# EAGLE schematic Board (EAGLE 7.1.0)
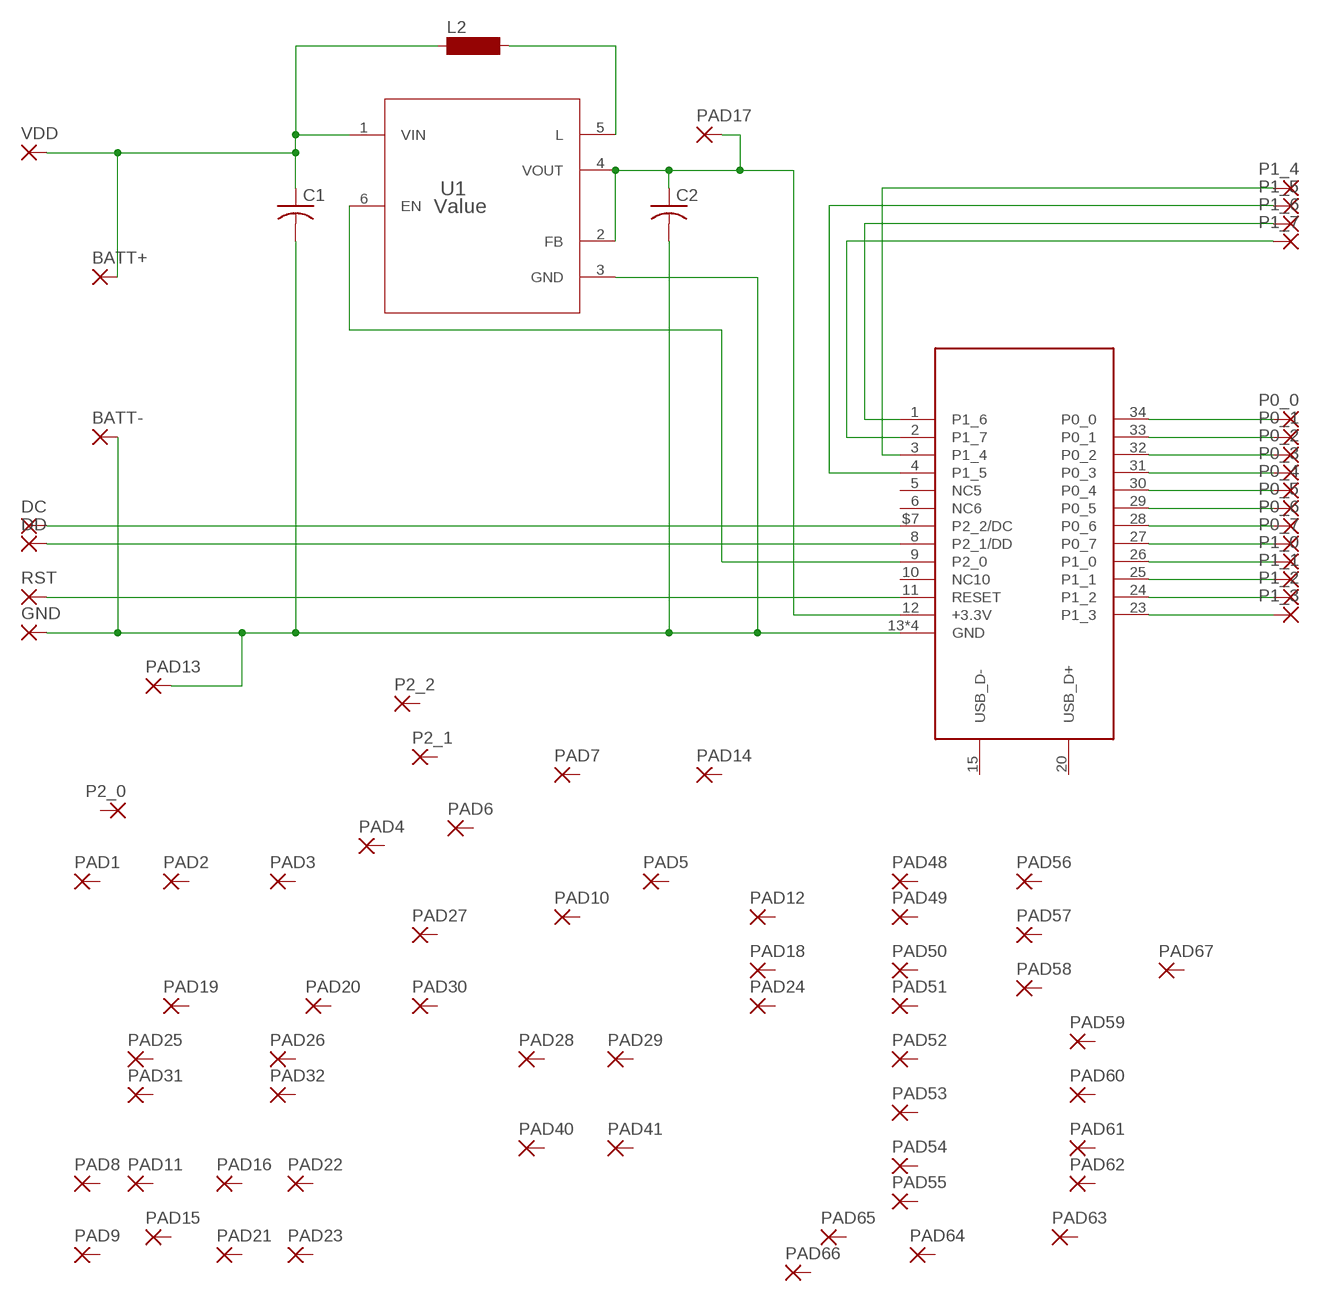
[diagram p0: schematic, sheet 1]

## Parts
BATT+  1,6/0,9  [1,6/0,9]
BATT-  1,6/0,9  [1,6/0,9]
C1  C-USC0402  [C0402]
C2  C-USC0402  [C0402]
DC  SMD2  [SMD1,27-2,54]
DD  SMD2  [SMD1,27-2,54]
E1  HM-10-BOARD  [26.9X13X2.2_BOARD]
GND  SMD2  [SMD1,27-2,54]
L2  SM-NE29  [SM-NE29]
P0_0  1,6/0,9  [1,6/0,9]
P0_1  1,6/0,9  [1,6/0,9]
P0_2  1,6/0,9  [1,6/0,9]
P0_3  1,6/0,9  [1,6/0,9]
P0_4  1,6/0,9  [1,6/0,9]
P0_5  1,6/0,9  [1,6/0,9]
P0_6  1,6/0,9  [1,6/0,9]
P0_7  1,6/0,9  [1,6/0,9]
P1_0  1,6/0,9  [1,6/0,9]
P1_1  1,6/0,9  [1,6/0,9]
P1_2  1,6/0,9  [1,6/0,9]
P1_3  1,6/0,9  [1,6/0,9]
P1_4  1,6/0,9  [1,6/0,9]
P1_5  1,6/0,9  [1,6/0,9]
P1_6  1,6/0,9  [1,6/0,9]
P1_7  1,6/0,9  [1,6/0,9]
P2_0  1,6/0,9  [1,6/0,9]
P2_1  1,6/0,9  [1,6/0,9]
P2_2  1,6/0,9  [1,6/0,9]
PAD1  1,6/0,9  [1,6/0,9]
PAD2  1,6/0,9  [1,6/0,9]
PAD3  1,6/0,9  [1,6/0,9]
PAD4  1,6/0,9  [1,6/0,9]
PAD5  1,6/0,9  [1,6/0,9]
PAD6  1,6/0,9  [1,6/0,9]
PAD7  1,6/0,9  [1,6/0,9]
PAD8  1,6/0,9  [1,6/0,9]
PAD9  1,6/0,9  [1,6/0,9]
PAD10  1,6/0,9  [1,6/0,9]
PAD11  1,6/0,9  [1,6/0,9]
PAD12  1,6/0,9  [1,6/0,9]
PAD13  1,6/0,9  [1,6/0,9]
PAD14  1,6/0,9  [1,6/0,9]
PAD15  1,6/0,9  [1,6/0,9]
PAD16  1,6/0,9  [1,6/0,9]
PAD17  1,6/0,9  [1,6/0,9]
PAD18  1,6/0,9  [1,6/0,9]
PAD19  1,6/0,9  [1,6/0,9]
PAD20  1,6/0,9  [1,6/0,9]
PAD21  1,6/0,9  [1,6/0,9]
PAD22  1,6/0,9  [1,6/0,9]
PAD23  1,6/0,9  [1,6/0,9]
PAD24  1,6/0,9  [1,6/0,9]
PAD25  1,6/0,9  [1,6/0,9]
PAD26  1,6/0,9  [1,6/0,9]
PAD27  1,6/0,9  [1,6/0,9]
PAD28  1,6/0,9  [1,6/0,9]
PAD29  1,6/0,9  [1,6/0,9]
PAD30  1,6/0,9  [1,6/0,9]
PAD31  1,6/0,9  [1,6/0,9]
PAD32  1,6/0,9  [1,6/0,9]
PAD40  1,6/0,9  [1,6/0,9]
PAD41  1,6/0,9  [1,6/0,9]
PAD48  1,6/0,9  [1,6/0,9]
PAD49  1,6/0,9  [1,6/0,9]
PAD50  1,6/0,9  [1,6/0,9]
PAD51  1,6/0,9  [1,6/0,9]
PAD52  1,6/0,9  [1,6/0,9]
PAD53  1,6/0,9  [1,6/0,9]
PAD54  1,6/0,9  [1,6/0,9]
PAD55  1,6/0,9  [1,6/0,9]
PAD56  1,6/0,9  [1,6/0,9]
PAD57  1,6/0,9  [1,6/0,9]
PAD58  1,6/0,9  [1,6/0,9]
PAD59  1,6/0,9  [1,6/0,9]
PAD60  1,6/0,9  [1,6/0,9]
PAD61  1,6/0,9  [1,6/0,9]
PAD62  1,6/0,9  [1,6/0,9]
PAD63  1,6/0,9  [1,6/0,9]
PAD64  1,6/0,9  [1,6/0,9]
PAD65  1,6/0,9  [1,6/0,9]
PAD66  1,6/0,9  [1,6/0,9]
PAD67  1,6/0,9  [1,6/0,9]
RST  SMD2  [SMD1,27-2,54]
U1  Value  TPS61221DCKR  [DCK0006A]
VDD  SMD2  [SMD1,27-2,54]

## Nets
3V3: C2.1 E1.12(+3.3V) PAD17.1(P) U1.2(FB) U1.4(VOUT)
DC: DC.1(P) E1.$7(P2_2/DC)
DD: DD.1(P) E1.8(P2_1/DD)
GND: BATT-.1(P) C1.2 C2.2 E1.13(GND) E1.14(GND) E1.21(GND) E1.22(GND) GND.1(P) PAD13.1(P) U1.3(GND)
N$1: E1.28(P0_6) P0_6.1(P)
N$2: E1.27(P0_7) P0_7.1(P)
N$6: E1.23(P1_3) P1_3.1(P)
N$7: E1.24(P1_2) P1_2.1(P)
N$8: E1.25(P1_1) P1_1.1(P)
N$9: E1.31(P0_3) P0_3.1(P)
N$10: E1.30(P0_4) P0_4.1(P)
N$11: E1.29(P0_5) P0_5.1(P)
N$12: E1.26(P1_0) P1_0.1(P)
N$13: E1.2(P1_7) P1_7.1(P)
N$14: E1.1(P1_6) P1_6.1(P)
N$15: E1.4(P1_5) P1_5.1(P)
N$16: E1.3(P1_4) P1_4.1(P)
N$17: E1.9(P2_0) U1.6(EN)
N$18: E1.32(P0_2) P0_2.1(P)
N$22: L2.2 U1.5(L)
P0_0: E1.34(P0_0) P0_0.1(P)
P0_1: E1.33(P0_1) P0_1.1(P)
RST: E1.11(RESET) RST.1(P)
VDD: BATT+.1(P) C1.1 L2.1 U1.1(VIN) VDD.1(P)
Unconnected: E1.5(NC5) E1.6(NC6) E1.10(NC10) E1.15(USB_D-) E1.20(USB_D+) P2_0.1(P) P2_1.1(P) P2_2.1(P) PAD1.1(P) PAD2.1(P) PAD3.1(P) PAD4.1(P) PAD5.1(P) PAD6.1(P) PAD7.1(P) PAD8.1(P) PAD9.1(P) PAD10.1(P) PAD11.1(P) PAD12.1(P) PAD14.1(P) PAD15.1(P) PAD16.1(P) PAD18.1(P) PAD19.1(P) PAD20.1(P) PAD21.1(P) PAD22.1(P) PAD23.1(P) PAD24.1(P) PAD25.1(P) PAD26.1(P) PAD27.1(P) PAD28.1(P) PAD29.1(P) PAD30.1(P) PAD31.1(P) PAD32.1(P) PAD40.1(P) PAD41.1(P) PAD48.1(P) PAD49.1(P) PAD50.1(P) PAD51.1(P) PAD52.1(P) PAD53.1(P) PAD54.1(P) PAD55.1(P) PAD56.1(P) PAD57.1(P) PAD58.1(P) PAD59.1(P) PAD60.1(P) PAD61.1(P) PAD62.1(P) PAD63.1(P) PAD64.1(P) PAD65.1(P) PAD66.1(P) PAD67.1(P)

## Library data of the parts
BATT+ BATT- P0_0 P0_1-P0_7 P1_0 P1_1-P1_7 P2_0 P2_1 P2_2 PAD1-PAD32 PAD40 PAD41 PAD48-PAD67 = pads:1,6/0,9: THROUGH-HOLE PAD
C1 C2 = resistor:C-US: CAPACITOR, American symbol
DC DD GND RST VDD = pads:SMD2: SMD PAD
E1 = HM-10:HM-10: HM Bluetooth module use TI CC2540 or CC2541, Master and slave roles in one, transmission version and remote control version and PIO state acquisition functions in one, Support the AT command modify module parameters, Convenient and flexible.
L2 = NR3015T4R7M:SM-NE29: INDUCTOR SMD chip inductor; OC_FARNELL: unknown; OC_NEWARK: unknown
U1 = tps61221:TPS61221DCKR; COMPTYPE: IC; MANUFACTURER: Texas Instruments; MOUNTTYPE: SMT; PACKAGEREFERENCE: DCK0006A; PARTNUMBER: TPS61221DCK; PIN_COUNT: 6; REFDES: RefDes; ROHS: Y; TYPE: TYPE